# Altium schematic sheet SH02-PERI.SchDoc
size A4
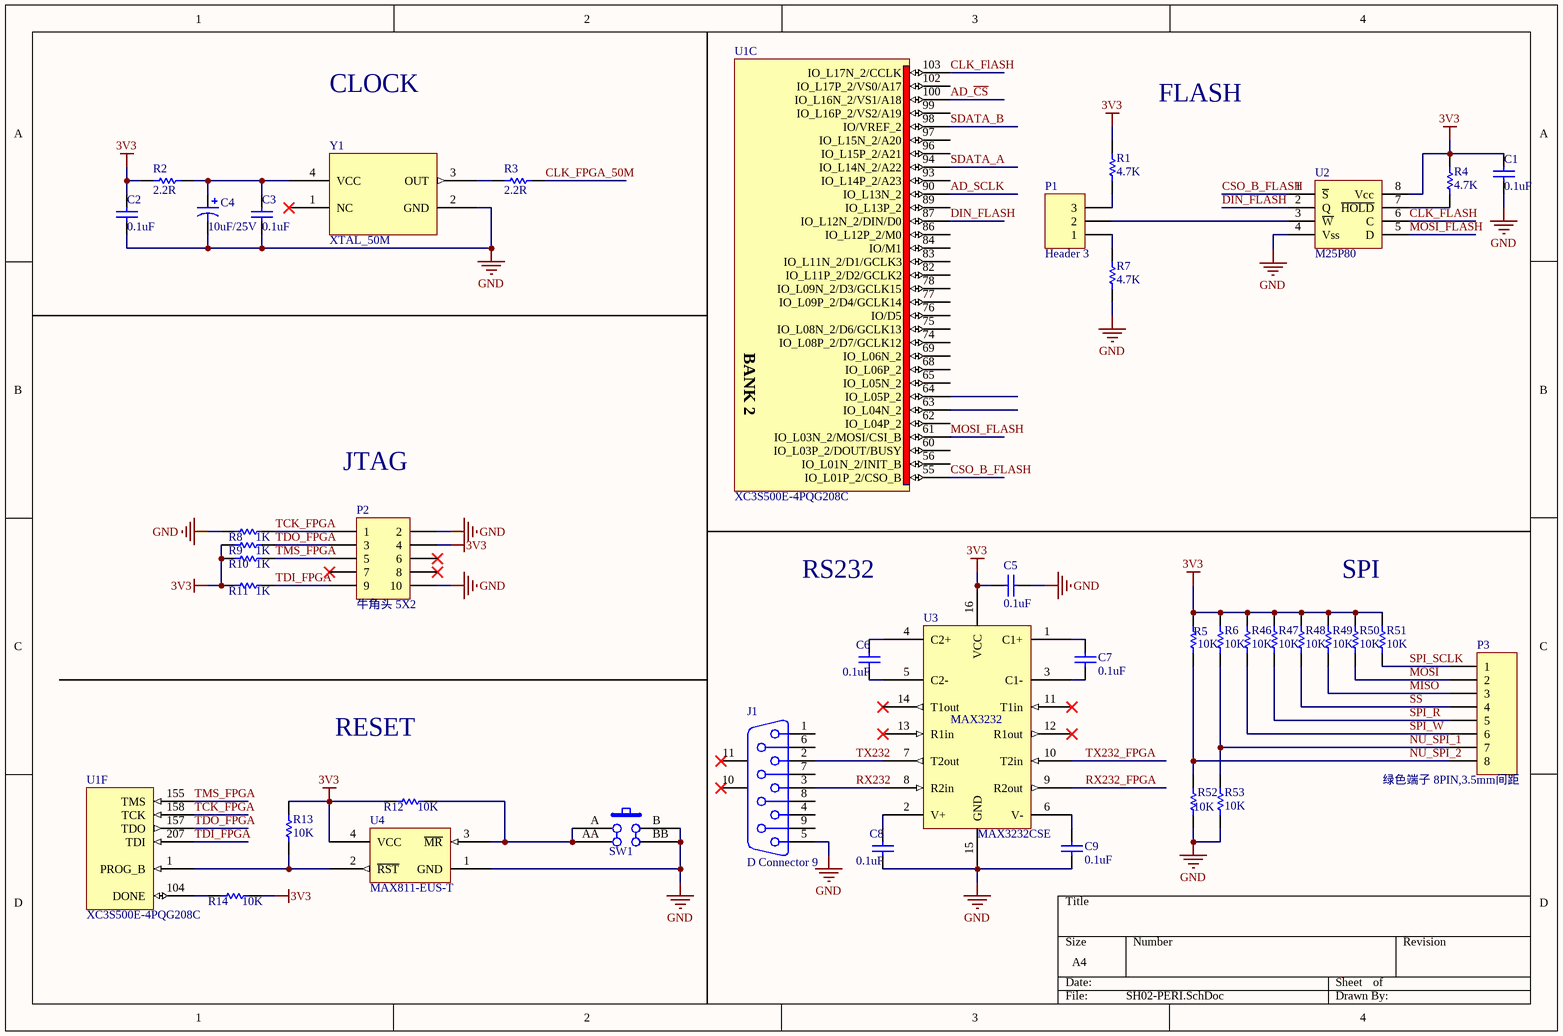
[diagram p0: SH02-PERI.SchDoc]

## Parts
C1  value 0.1uF  [1608[0603]]  (hidden comment: Cap,0.1uF/0603)
C2  value 0.1uF  [1608[0603]]  (hidden comment: Cap,0.1uF/0603)
C3  value 0.1uF  [1608[0603]]  (hidden comment: Cap,0.1uF/0603)
C4  value 10uF/25V  [1206[3216]]  (hidden comment: Cap Pol,10uF/25V,1206)
C5  value 0.1uF  [1608[0603]]  (hidden comment: Cap,0.1uF/0603)
C6  value 0.1uF  [1608[0603]]  (hidden comment: Cap,0.1uF/0603)
C7  value 0.1uF  [1608[0603]]  (hidden comment: Cap,0.1uF/0603)
C8  value 0.1uF  [1608[0603]]  (hidden comment: Cap,0.1uF/0603)
C9  value 0.1uF  [1608[0603]]  (hidden comment: Cap,0.1uF/0603)
J1  D Connector 9  [DSUB1.385-2H9]
P1  Header 3  [HDR1X3]
P2  牛角头 5X2  [10Pin - JTAG]
P3  绿色端子 8PIN,3.5mm间距  [8PIN]
R1  value 4.7K  [1608[0603]]  (hidden comment: Res,4.7K/0603)
R2  value 2.2R  [1608[0603]]  (hidden comment: Res,2.2R/0603)
R3  value 2.2R  [1608[0603]]  (hidden comment: Res,2.2R/0603)
R4  value 4.7K  [1608[0603]]  (hidden comment: Res,4.7K/0603)
R5  value 10K  [1608[0603]]  (hidden comment: Res,10K/0603)
R6  value 10K  [1608[0603]]  (hidden comment: Res,10K/0603)
R7  value 4.7K  [1608[0603]]  (hidden comment: Res,4.7K/0603)
R8  value 1K  [1608[0603]]  (hidden comment: Res,1K/0603)
R9  value 1K  [1608[0603]]  (hidden comment: Res,1K/0603)
R10  value 1K  [1608[0603]]  (hidden comment: Res,1K/0603)
R11  value 1K  [1608[0603]]  (hidden comment: Res,1K/0603)
R12  value 10K  [1608[0603]]  (hidden comment: Res,10K/0603)
R13  value 10K  [1608[0603]]  (hidden comment: Res,10K/0603)
R14  value 10K  [1608[0603]]  (hidden comment: Res,10K/0603)
R46  value 10K  [1608[0603]]  (hidden comment: Res,10K/0603)
R47  value 10K  [1608[0603]]  (hidden comment: Res,10K/0603)
R48  value 10K  [1608[0603]]  (hidden comment: Res,10K/0603)
R49  value 10K  [1608[0603]]  (hidden comment: Res,10K/0603)
R50  value 10K  [1608[0603]]  (hidden comment: Res,10K/0603)
R51  value 10K  [1608[0603]]  (hidden comment: Res,10K/0603)
R52  value 10K  [1608[0603]]  (hidden comment: Res,10K/0603,NoPoP)
R53  value 10K  [1608[0603]]  (hidden comment: Res,10K/0603,NoPoP)
SW1  SW,EVQPLMA15_1  [PUSHBUTTONSW]  (value not drawn)
U1  XC3S500E-4PQG208C  [PQG208_N]  (parts C,F of 8)
U2  M25P80  [SOIC127P600X175-8N]
U3  MAX3232CSE  [NSO16]
U4  MAX811-EUS-T  [SOT143]
Y1  XTAL_50M  [CRY_4Pin_50M]

## Nets
3V3: C1.1 C2.1 C5.1 P2.4 R1.2 R2.1 R4.2 R5.1 R6.1 R9.2 R10.2 R11.2 R12.2 R13.1 R14.1 R46.1 R47.1 R48.1 R49.1 R50.1 R51.1 U2.8(Vcc) U3.16(VCC) U4.4(VCC)
GND: C1.2 C2.2 C3.2 C4.2 C5.2 C8.2 C9.1 J1.5 P2.2 P2.10 R7.1 R8.2 R52.2 R53.2 SW1.B SW1.BB U2.4(Vss) U3.15(GND) U4.1(GND) Y1.2(GND)
AD_~{CS}: U1.100(IO_L16N_2/VS1/A18)
AD_SCLK: U1.90(IO_L13N_2)
CLK_FLASH: U1.103(IO_L17N_2/CCLK) U2.6(C)
CLK_FPGA_50M: R3.2
CSO_B_FLASH: U1.55(IO_L01P_2/CSO_B) U2.1(~{S})
DIN_FLASH: U1.87(IO_L12N_2/DIN/D0) U2.2(Q)
MISO: P3.3 R49.2
MOSI: P3.2 R50.2
MOSI_FLASH: U1.61(IO_L03N_2/MOSI/CSI_B) U2.5(D)
NU_SPI_1: P3.7 R6.2 R53.1
NU_SPI_2: P3.8 R5.2 R52.1
RX232: J1.3 U3.8(R2in)
RX232_FPGA: U3.9(R2out)
SDATA_A: U1.94(IO_L14N_2/A22)
SDATA_B: U1.98(IO/VREF_2)
SPI_R: P3.5 R47.2
SPI_SCLK: P3.1 R51.2
SPI_W: P3.6 R46.2
SS: P3.4 R48.2
TCK_FPGA: P2.1 R8.1 U1.158(TCK)
TDI_FPGA: P2.9 R11.1 U1.207(TDI)
TDO_FPGA: P2.3 R9.1 U1.157(TDO)
TMS_FPGA: P2.5 R10.1 U1.155(TMS)
TX232: J1.2 U3.7(T2out)
TX232_FPGA: U3.10(T2in)
NetC3_1: C3.1 C4.1 R2.2 Y1.4(VCC)
NetC6_1: C6.1 U3.4(C2+)
NetC6_2: C6.2 U3.5(C2-)
NetC7_1: C7.1 U3.3(C1-)
NetC7_2: C7.2 U3.1(C1+)
NetC8_1: C8.1 U3.2(V+)
NetC9_2: C9.2 U3.6(V-)
NetP1_1: P1.1 R7.2
NetP1_2: P1.2 U2.3(~{W})
NetP1_3: P1.3 R1.1
NetR3_1: R3.1 Y1.3(OUT)
NetR4_1: R4.1 U2.7(~{HOLD})
NetR12_1: R12.1 SW1.A SW1.AA U4.3(~{MR})
NetR13_2: R13.2 U1.1(PROG_B) U4.2(~{RST})
NetR14_2: R14.2 U1.104(DONE)

Not connected (* = marked no-connect by the designer): J1 1 4 6 7 8 9 10(MH1)* 11(MH2)*; P2 6* 7* 8*; U1 56(IO_L01N_2/INIT_B) 60(IO_L03P_2/DOUT/BUSY) 62(IO_L04P_2) 63(IO_L04N_2) 64(IO_L05P_2) 65(IO_L05N_2) 68(IO_L06P_2) 69(IO_L06N_2) 74(IO_L08P_2/D7/GCLK12) 75(IO_L08N_2/D6/GCLK13) 76(IO/D5) 77(IO_L09P_2/D4/GCLK14) 78(IO_L09N_2/D3/GCLK15) 82(IO_L11P_2/D2/GCLK2) 83(IO_L11N_2/D1/GCLK3) 84(IO/M1) 86(IO_L12P_2/M0) 89(IO_L13P_2) 93(IO_L14P_2/A23) 96(IO_L15P_2/A21) 97(IO_L15N_2/A20) 99(IO_L16P_2/VS2/A19) 102(IO_L17P_2/VS0/A17); U3 11(T1in)* 12(R1out)* 13(R1in)* 14(T1out)*; Y1 1(NC)*

## Notes on the sheet
- CLOCK
- FLASH
- JTAG
- RS232
- SPI
- RESET
- (in symbol XC3S500E-4PQG208C, part C) BANK 2

## Library data of the parts
C1-C3 C5-C9 = Cap: Capacitor; Published: 8-Jun-2000; LatestRevisionDate: 17-Jul-2002; LatestRevisionNote: Re-released for DXP Platform.; PackageReference: RAD-0.3; Publisher: Altium Limited
C4 = Cap Pol1: Polarized Capacitor (Radial); Published: 8-Jun-2000; LatestRevisionDate: 17-Jul-2002; LatestRevisionNote: Re-released for DXP Platform.; PackageReference: RB7.6-15; Publisher: Altium Limited
J1 = D Connector 9: Receptacle Assembly, 9 Position, Right Angle; PackageDocument: O; Positions: 9; Published: 15-Jun-2001; LatestRevisionDate: 17-Jul-2002; LatestRevisionNote: Re-released for DXP Platform.; DatasheetDocument: 1-Sep-1999; PackageReference: 788750; Publisher: Altium Limited; Orientation: Right Angle; Gender: Receptacle
P1 = Header 3: Header, 3-Pin; LatestRevisionDate: 17-Jul-2002; LatestRevisionNote: Re-released for DXP Platform.; Publisher: Altium Limited
P2 = Header 5X2: Header, 5-Pin, Dual row; LatestRevisionDate: 17-Jul-2002; LatestRevisionNote: Re-released for DXP Platform.; Publisher: Altium Limited
P3 = Header 8: Header, 8-Pin; LatestRevisionDate: 17-Jul-2002; LatestRevisionNote: Re-released for DXP Platform.; Publisher: Altium Limited
R1-R14 R46-R53 = Res1: Resistor; Published: 8-Jun-2000; LatestRevisionDate: 17-Jul-2002; LatestRevisionNote: Re-released for DXP Platform.; PackageReference: AXIAL-0.3; Publisher: Altium Limited
SW1 = PUSHBUTTON SW
U1 = XC3S500E-4PQG208C: Spartan-3E 1.2V FPGA, 158 User I/Os, 208-Pin Pb-Free PQFP, Standard Performance, Commercial Grade; Published: 6-Jun-2005; LatestRevisionDate: 13-Apr-2006; LatestRevisionNote: IPC-7351 Footprint Added.; DatasheetVersion: 16-Mar-2007; PackageVersion: ver1.2, Jun-2004; PackageReference: PQG208; Publisher: Altium Limited; PackageDescription: 208-Pin Plastic Quad Flat Pack (PQG208) - Pb-Free; Code_JEDEC: MS-029-FA-1; ComponentLink1Description: Manufacturer Link; ComponentLink1URL: http://www.xilinx.com/products/silicon_solutions/fpgas/spartan_series/spartan3e_fpgas/index.htm; ComponentLink2Description: Datasheet; ComponentLink2URL: http://direct.xilinx.com/bvdocs/publications/ds312.pdf
U3 = MAX3232: Text Field1: 60; Text Field2: 150
U4 = MAX811
Y1 = XTAL